# Altium schematic sheet Primjenjena_II.SchDoc: Schematic
size A3; DrawnBy: Grupa 5; Revision: v1.1; SheetNumber: 1
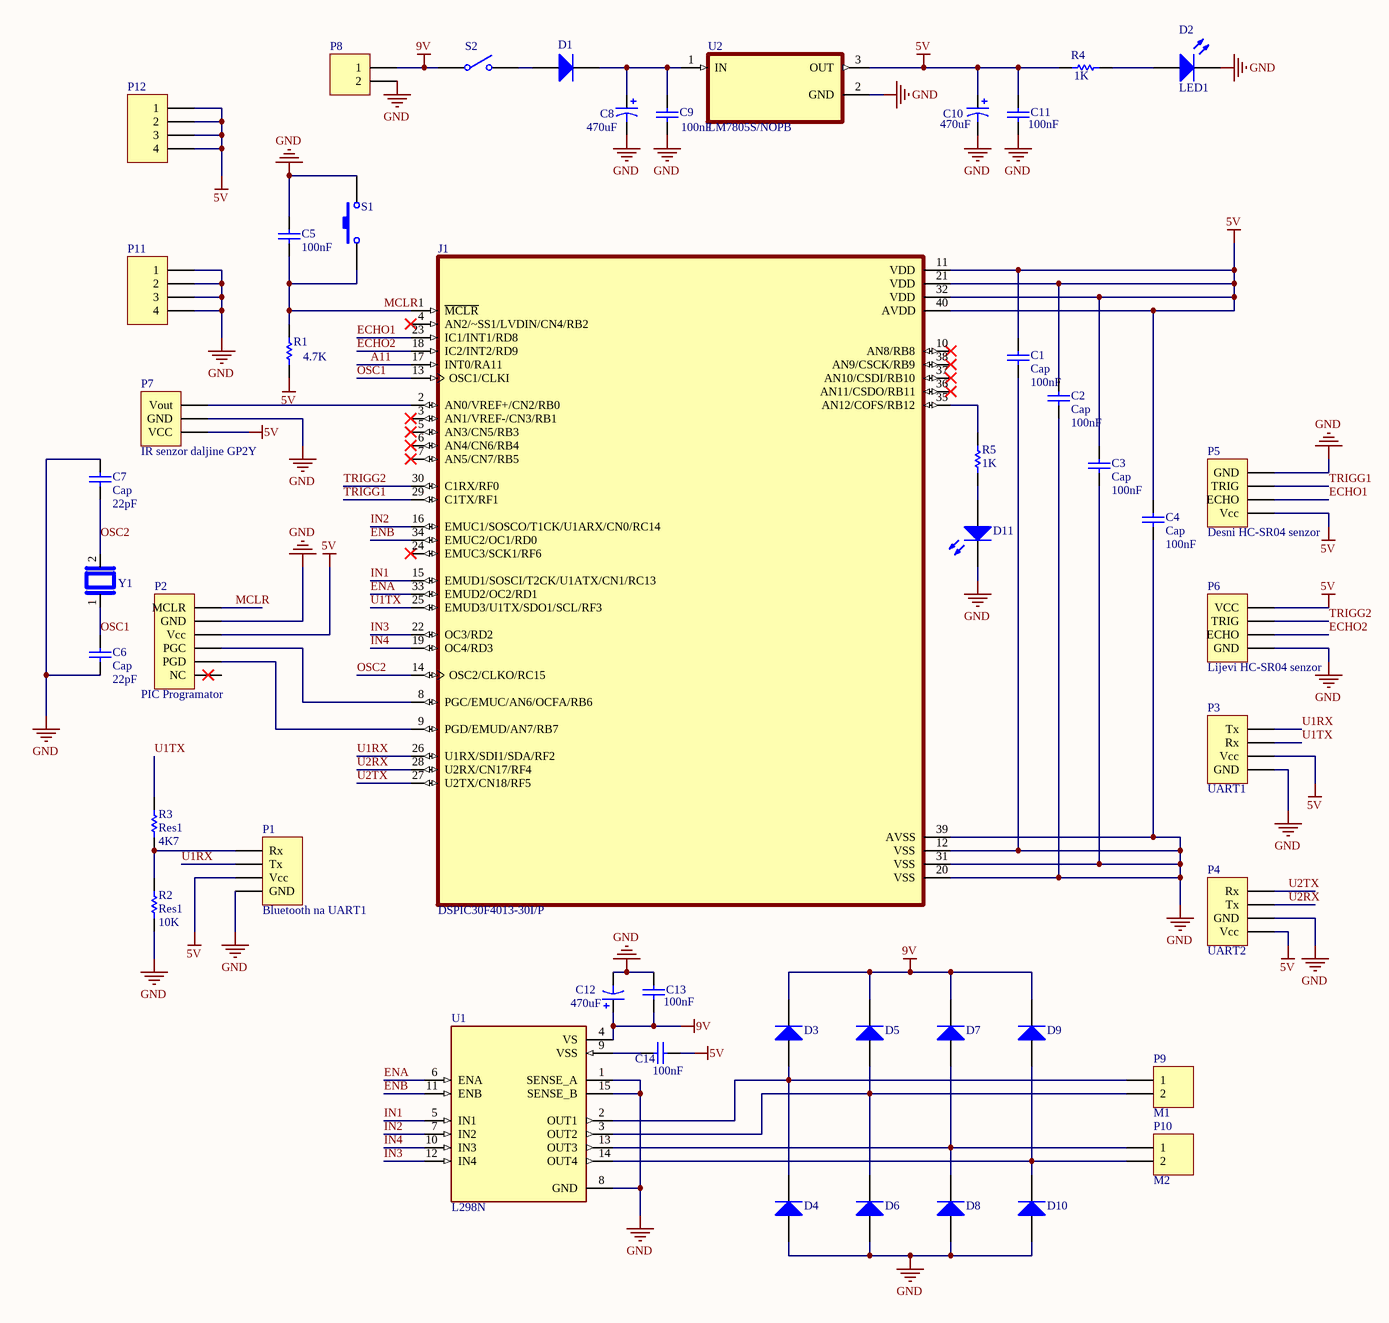
[diagram p0: Primjenjena_II.SchDoc]

## Parts
C1  Cap  value 100nF  [RAD-0.1]
C2  Cap  value 100nF  [RAD-0.1]
C3  Cap  value 100nF  [RAD-0.1]
C4  Cap  value 100nF  [RAD-0.1]
C5  value 100nF  [RAD-0.1]  (hidden comment: Cap)
C6  Cap  value 22pF  [RAD-0.1]
C7  Cap  value 22pF  [RAD-0.1]
C8  value 470uF  [Elektrolitski kondenzator]  (hidden comment: Cap Pol1)
C9  value 100nF  [RAD-0.1]  (hidden comment: Cap)
C10  value 470uF  [Elektrolitski kondenzator]  (hidden comment: Cap Pol1)
C11  value 100nF  [RAD-0.1]  (hidden comment: Cap)
C12  value 470uF  [Elektrolitski kondenzator]  (hidden comment: Cap Pol1)
C13  value 100nF  [RAD-0.1]  (hidden comment: Cap)
C14  value 100nF  [RAD-0.1]  (hidden comment: Cap)
D1  Diode 1N4007  [DO-41]  (value not drawn)
D2  LED1  [Diode]
D3  Diode  [DO-41]  (value not drawn)
D4  Diode  [DO-41]  (value not drawn)
D5  Diode  [DO-41]  (value not drawn)
D6  Diode  [DO-41]  (value not drawn)
D7  Diode  [DO-41]  (value not drawn)
D8  Diode  [DO-41]  (value not drawn)
D9  Diode  [DO-41]  (value not drawn)
D10  Diode  [DO-41]  (value not drawn)
D11  LED1  [Diode]  (value not drawn)
J1  DSPIC30F4013-30I/P  [DIP254P1524X482-40]
P1  Bluetooth na UART1  [HDR1X4]
P2  PIC Programator  [HDR1X6]
P3  UART1  [HDR1X4]
P4  UART2  [HDR1X4]
P5  Desni HC-SR04 senzor  [HDR1X4]
P6  Lijevi HC-SR04 senzor  [HDR1X4]
P7  IR senzor daljine GP2Y  [HDR1X3]
P8  Header 2  [HDR1X2]  (value not drawn)
P9  M1  [HDR1X2]
P10  M2  [HDR1X2]
P11  Header 4  [HDR1X4]  (value not drawn)
P12  Header 4  [HDR1X4]  (value not drawn)
R1  value 4.7K  [AXIAL-0.3]  (hidden comment: Res1)
R2  Res1  value 10K  [AXIAL-0.3]
R3  Res1  value 4K7  [AXIAL-0.3]
R4  value 1K  [AXIAL-0.3]  (hidden comment: Res1)
R5  value 1K  [AXIAL-0.3]  (hidden comment: Res1)
S1  SW-PB  [SPST-2]  (value not drawn)
S2  SW-SPST  [SPST-2]  (value not drawn)
U1  L298N  [TO127P2020X500X2100-15]
U2  LM7805S/NOPB  [TO-220-AB]
Y1  HC-49/U-S16000000ABJB  [XTAL_HC49P488W43L1150T466H350]  (value not drawn)

## Nets
5V: C1.2 C2.2 C3.2 C4.2 C10.1 C11.2 C14.1 J1.11(VDD) J1.21(VDD) J1.32(VDD) J1.40(AVDD) P1.3(Vcc) P2.3(Vcc) P3.3(Vcc) P4.4(Vcc) P5.4(Vcc) P6.1(VCC) P7.3(VCC) P12.1 P12.2 P12.3 P12.4 R1.1 R4.1 U2.3(OUT)
9V: C12.1 C13.1 D3.2(K) D5.2(K) D7.2(K) D9.2(K) P8.1 S2.1(COMMON) U1.4(VS)
GND: C1.1 C2.1 C3.1 C4.1 C5.2 C6.1 C7.2 C8.2 C9.1 C10.2 C11.1 C12.2 C13.2 D2.2(K) D4.1(A) D6.1(A) D8.1(A) D10.1(A) D11.2(K) J1.12(VSS) J1.20(VSS) J1.31(VSS) J1.39(AVSS) P1.4(GND) P2.2(GND) P3.4(GND) P4.3(GND) P5.1(GND) P6.4(GND) P7.2(GND) P8.2 P11.1 P11.2 P11.3 P11.4 R2.1 S1.2 U1.1(SENSE_A) U1.8(GND) U1.15(SENSE_B) U2.2(GND)
A11: J1.17(INT0/RA11)
ECHO1: J1.23(IC1/INT1/RD8) P5.3(ECHO)
ECHO2: J1.18(IC2/INT2/RD9) P6.3(ECHO)
ENA: J1.33(EMUD2/OC2/RD1) U1.6(ENA)
ENB: J1.34(EMUC2/OC1/RD0) U1.11(ENB)
IN1: J1.15(EMUD1/SOSCI/T2CK/U1ATX/CN1/RC13) U1.5(IN1)
IN2: J1.16(EMUC1/SOSCO/T1CK/U1ARX/CN0/RC14) U1.7(IN2)
IN3: J1.22(OC3/RD2) U1.12(IN4)
IN4: J1.19(OC4/RD3) U1.10(IN3)
MCLR: C5.1 J1.1(~{MCLR}) P2.1(MCLR) R1.2 S1.1
OSC1: C6.2 J1.13(OSC1/CLKI) Y1.1
OSC2: C7.1 J1.14(OSC2/CLKO/RC15) Y1.2
TRIGG1: J1.29(C1TX/RF1) P5.2(TRIG)
TRIGG2: J1.30(C1RX/RF0) P6.2(TRIG)
U1RX: J1.26(U1RX/SDI1/SDA/RF2) P1.2(Tx) P3.1(Tx)
U1TX: J1.25(EMUD3/U1TX/SDO1/SCL/RF3) P3.2(Rx) R3.2
U2RX: J1.28(U2RX/CN17/RF4) P4.2(Tx)
U2TX: J1.27(U2TX/CN18/RF5) P4.1(Rx)
NetC8_1: C8.1 C9.2 D1.2(K) U2.1(IN)
NetC14_2: C14.2 U1.9(VSS)
NetD1_1: D1.1(A) S2.2(NO)
NetD2_1: D2.1(A) R4.2
NetD3_1: D3.1(A) D4.2(K) P9.1 U1.2(OUT1)
NetD5_1: D5.1(A) D6.2(K) P9.2 U1.3(OUT2)
NetD7_1: D7.1(A) D8.2(K) P10.1 U1.13(OUT3)
NetD9_1: D9.1(A) D10.2(K) P10.2 U1.14(OUT4)
NetD11_1: D11.1(A) R5.1
NetJ1_2: J1.2(AN0/VREF+/CN2/RB0) P7.1(Vout)
NetJ1_8: J1.8(PGC/EMUC/AN6/OCFA/RB6) P2.4(PGC)
NetJ1_9: J1.9(PGD/EMUD/AN7/RB7) P2.5(PGD)
NetJ1_35: J1.35(AN12/COFS/RB12) R5.2
NetP1_1: P1.1(Rx) R2.2 R3.1

Not connected (* = marked no-connect by the designer): J1 3(AN1/VREF-/CN3/RB1)* 4(AN2/~SS1/LVDIN/CN4/RB2)* 5(AN3/CN5/RB3)* 6(AN4/CN6/RB4)* 7(AN5/CN7/RB5)* 10(AN8/RB8)* 24(EMUC3/SCK1/RF6)* 36(AN11/CSDO/RB11)* 37(AN10/CSDI/RB10)* 38(AN9/CSCK/RB9)*; P2 6(NC)

## Library data of the parts
C1-C7 C9 C11 C13 C14 = Cap: Capacitor; Published: 8-Jun-2000; LatestRevisionDate: 17-Jul-2002; LatestRevisionNote: Re-released for DXP Platform.; PackageReference: RAD-0.3; Publisher: Altium Limited; PackageDescription: Radial Cap, Thru-Hole; 2 Leads; 0.3 in Pin Spacing
C8 C10 C12 = Cap Pol1: Polarized Capacitor (Radial); Published: 8-Jun-2000; LatestRevisionDate: 17-Jul-2002; LatestRevisionNote: Re-released for DXP Platform.; PackageReference: RB7.6-15; Publisher: Altium Limited; PackageDescription: Polarized Capacitor (Radial); 2 Leads
D1 = Diode 1N4007: 1 Amp General Purpose Rectifier; Published: 8-Jun-2000; LatestRevisionDate: 17-Jul-2002; LatestRevisionNote: Re-released for DXP Platform.; DatasheetVersion: 1998; PackageVersion: Aug-1999; PackageReference: DO-41; Publisher: Altium Limited; PackageDescription: Diode, Axial; Body 5.2 x 2.7 mm (LxDia. max), Lead Dia. 0.86 mm (max); Code_JEDEC: DO-204-AL; ComponentLink1Description: Manufacturer Link; ComponentLink1URL: http://www.fairchildsemi.com/; ComponentLink2Description: Datasheet; ComponentLink2URL: http://www.fairchildsemi.com/ds/1N%2F1N4001.pdf
D2 D11 = LED1: Typical RED GaAs LED; Published: 8-Jun-2000; LatestRevisionDate: 08-Jul-2005; LatestRevisionNote: Mech Layer 1 removed.; PackageReference: LED-1; Publisher: Altium Limited; PackageDescription: LED; 2 Leads
D3-D10 = Diode: Default Diode; Published: 8-Jun-2000; LatestRevisionDate: 17-Jul-2002; LatestRevisionNote: Re-released for DXP Platform.; PackageVersion: Sep-1996; PackageReference: SMC; Publisher: Altium Limited; PackageDescription: DO-214-AB/SMC; 2 C-Bend Leads; Body 7.9 x 5.9 mm, inc. leads (LxW); Code_JEDEC: DO-214-AB
J1 = DSPIC30F4013-30I/P: Digital Signal Processors, DSP, DSC General Purpose | Microchip Technology Inc. DSPIC30F4013-30I/P; SnapEDA_Link: https://www.snapeda.com/parts/DSPIC30F4013-30I/P/Microchip/view-part/?ref=snap; Package: DIP-40 Microchip; Value: *; MF: Microchip; MP: DSPIC30F4013-30I/P; Check_prices: https://www.snapeda.com/parts/DSPIC30F4013-30I/P/Microchip/view-part/?ref=eda
P1 P3-P6 P11 P12 = Header 4: Header, 4-Pin; LatestRevisionDate: 17-Jul-2002; LatestRevisionNote: Re-released for DXP Platform.; Publisher: Altium Limited
P2 = Header 6: Header, 6-Pin; LatestRevisionDate: 17-Jul-2002; LatestRevisionNote: Re-released for DXP Platform.; Publisher: Altium Limited
P7 = Header 3: Header, 3-Pin; LatestRevisionDate: 17-Jul-2002; LatestRevisionNote: Re-released for DXP Platform.; Publisher: Altium Limited
P8-P10 = Header 2: Header, 2-Pin; LatestRevisionDate: 17-Jul-2002; LatestRevisionNote: Re-released for DXP Platform.; Publisher: Altium Limited
R1-R5 = Res1: Resistor; Published: 8-Jun-2000; LatestRevisionDate: 17-Jul-2002; LatestRevisionNote: Re-released for DXP Platform.; PackageReference: AXIAL-0.3; Publisher: Altium Limited; PackageDescription: Axial Device, Thru-Hole; 2 Leads; 0.3 in Pin Spacing
S1 = SW-PB: Switch; Published: 24-Mar-1999; LatestRevisionDate: 17-Jul-2002; LatestRevisionNote: Re-released for DXP Platform.; PackageReference: SPST-2; Publisher: Altium Limited; PackageDescription: Switch; 2 Leads
S2 = SW-SPST: Single-Pole, Single-Throw Switch; Published: 24-Mar-1999; LatestRevisionDate: 17-Jul-2002; LatestRevisionNote: Re-released for DXP Platform.; PackageReference: SPST-2; Publisher: Altium Limited; PackageDescription: Switch; 2 Leads
U1 = L298N: Dual Full Bridge Motor Driver 15-Pin(15+Tab) MULTIWATT V Tube; MP: L298N; Availability: Unavailable; Package: None; Value: *; Price: None
U2 = LM7805S/NOPB: 1.5-A, 30-V, linear voltage regulator; MF: Texas Instruments; SnapEDA_Link: https://www.snapeda.com/parts/LM7805S/NOPB/Texas+Instruments/view-part/?ref=snap; Package: TO263-3 Texas Instruments; Value: *; MP: LM7805S/NOPB; Check_prices: https://www.snapeda.com/parts/LM7805S/NOPB/Texas+Instruments/view-part/?ref=eda
Y1 = HC-49/U-S16000000ABJB: 16 MHz Â±30ppm Crystal 18pF 50 Ohms HC-49/US; MF: Citizen Finedevice; SnapEDA_Link: https://www.snapeda.com/parts/HC-49/U-S16000000ABJB/Citizen/view-part/?ref=snap; Package: HC-49/US Citizen Finetech Miyota; Value: *; MP: HC-49/U-S16000000ABJB; Check_prices: https://www.snapeda.com/parts/HC-49/U-S16000000ABJB/Citizen/view-part/?ref=eda